# Altium schematic sheet 05 - SAMA7G54-DDR3.SchDoc
size B; CompanyName: Microchip Technology Inc.; Organization: Microchip Technology; Address1: 2355 West Chandler Blvd.; Address2: Chandler, AZ  85224; Address4: USA; SheetNumber: 6; SheetTotal: 15; SheetTitle: SAMA7G5-DDR3; Time: Time
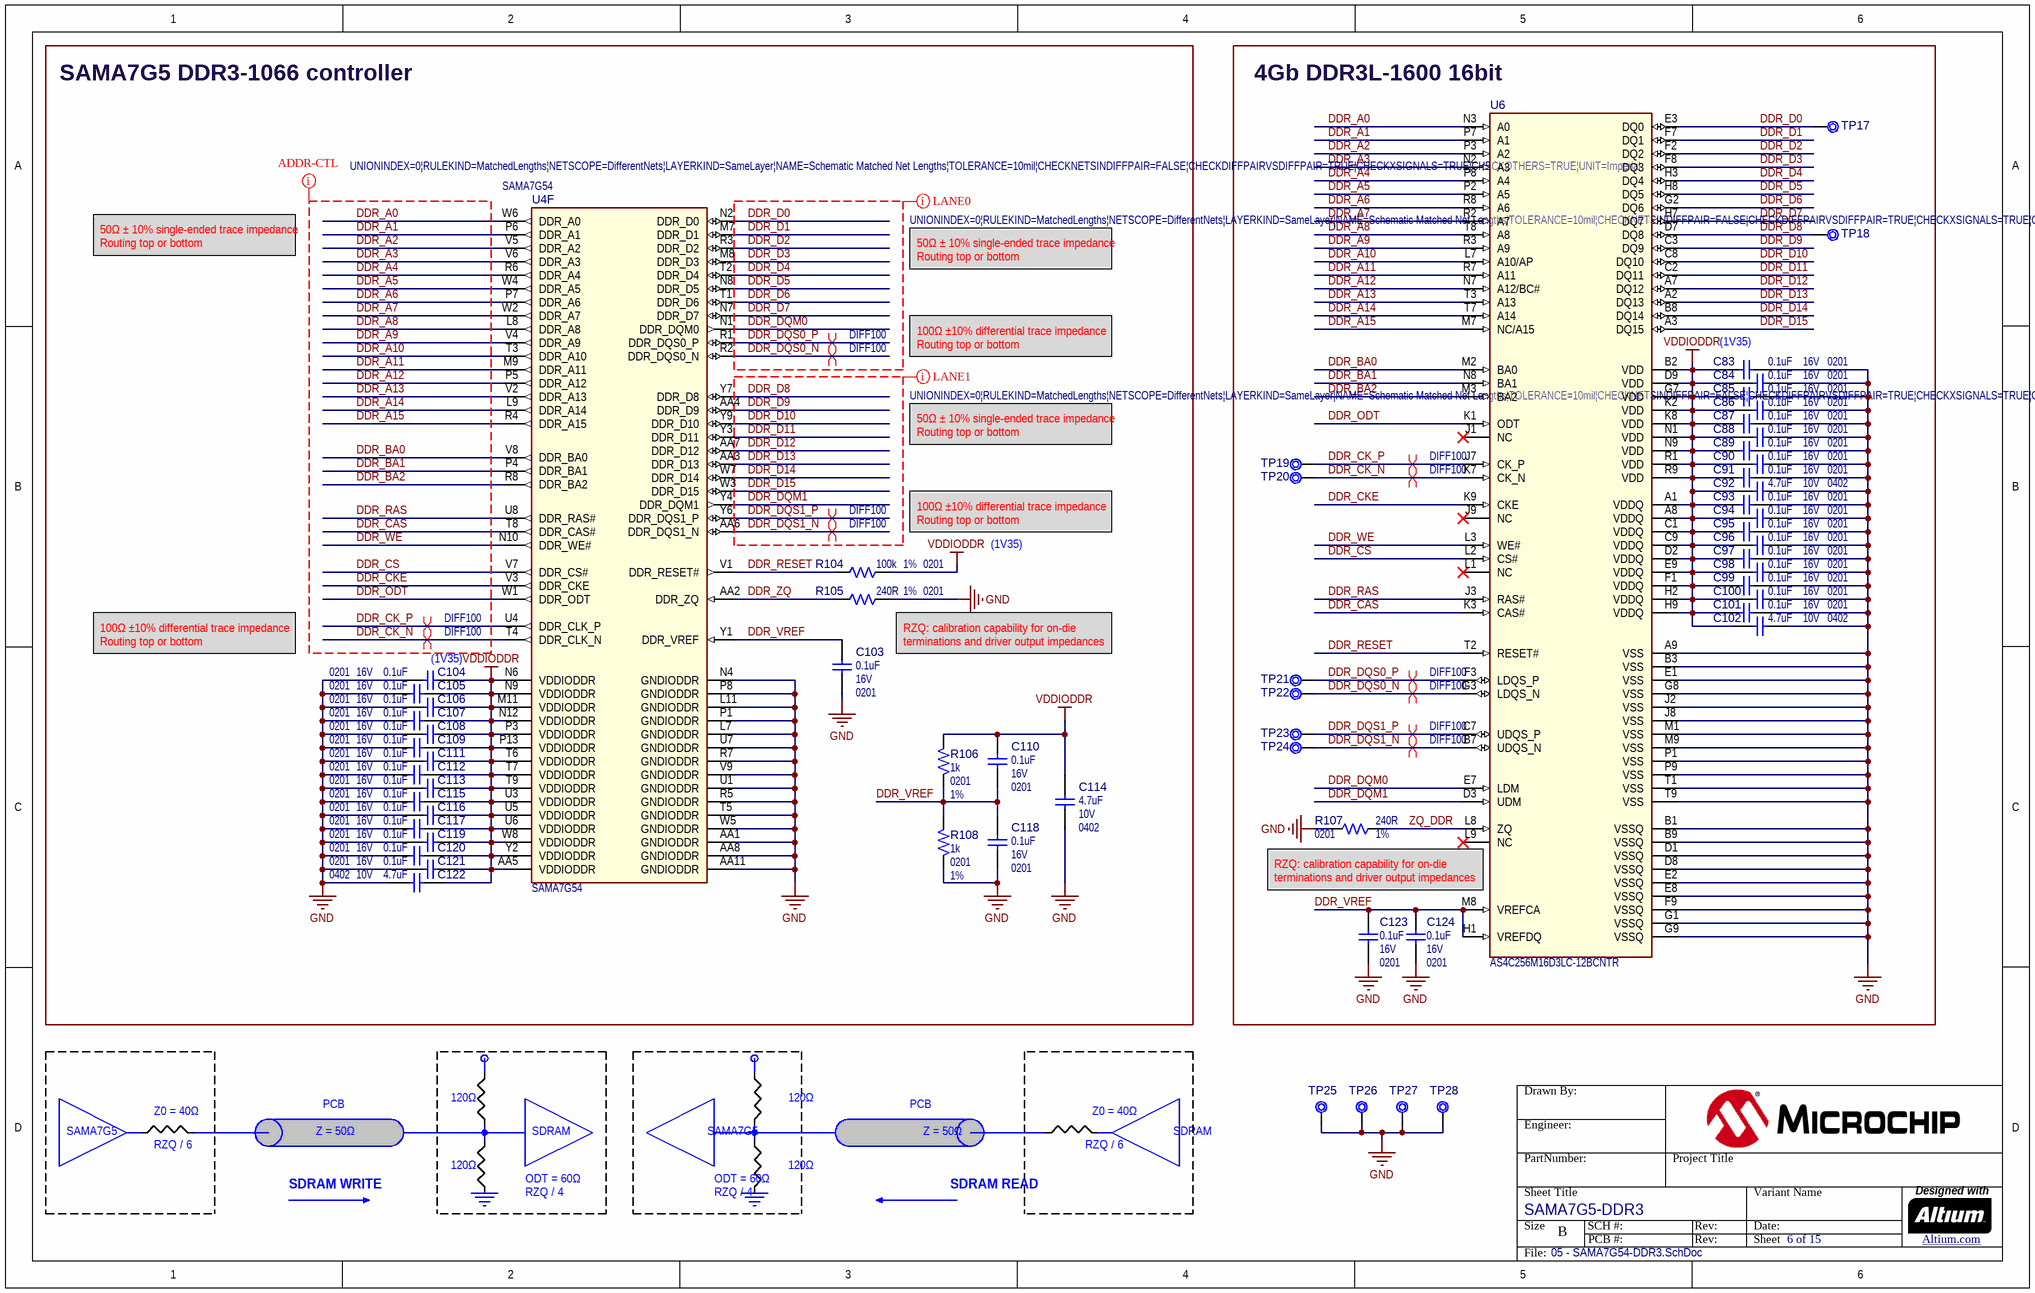
[diagram p0: 05 - SAMA7G54-DDR3.SchDoc]

## Parts
?  (no value)  (graphical)
C83  value 0.1uF  Voltage: 16V  Package: 0201  [CAP_C_0201]  (hidden comment: Capacitor NP)
C84  value 0.1uF  Voltage: 16V  Package: 0201  [CAP_C_0201]  (hidden comment: Capacitor NP)
C85  value 0.1uF  Voltage: 16V  Package: 0201  [CAP_C_0201]  (hidden comment: Capacitor NP)
C86  value 0.1uF  Voltage: 16V  Package: 0201  [CAP_C_0201]  (hidden comment: Capacitor NP)
C87  value 0.1uF  Voltage: 16V  Package: 0201  [CAP_C_0201]  (hidden comment: Capacitor NP)
C88  value 0.1uF  Voltage: 16V  Package: 0201  [CAP_C_0201]  (hidden comment: Capacitor NP)
C89  value 0.1uF  Voltage: 16V  Package: 0201  [CAP_C_0201]  (hidden comment: Capacitor NP)
C90  value 0.1uF  Voltage: 16V  Package: 0201  [CAP_C_0201]  (hidden comment: Capacitor NP)
C91  value 0.1uF  Voltage: 16V  Package: 0201  [CAP_C_0201]  (hidden comment: Capacitor NP)
C92  value 4.7uF  Voltage: 10V  Package: 0402  [CAP_C_0402]  (hidden comment: Capacitor NP)
C93  value 0.1uF  Voltage: 16V  Package: 0201  [CAP_C_0201]  (hidden comment: Capacitor NP)
C94  value 0.1uF  Voltage: 16V  Package: 0201  [CAP_C_0201]  (hidden comment: Capacitor NP)
C95  value 0.1uF  Voltage: 16V  Package: 0201  [CAP_C_0201]  (hidden comment: Capacitor NP)
C96  value 0.1uF  Voltage: 16V  Package: 0201  [CAP_C_0201]  (hidden comment: Capacitor NP)
C97  value 0.1uF  Voltage: 16V  Package: 0201  [CAP_C_0201]  (hidden comment: Capacitor NP)
C98  value 0.1uF  Voltage: 16V  Package: 0201  [CAP_C_0201]  (hidden comment: Capacitor NP)
C99  value 0.1uF  Voltage: 16V  Package: 0201  [CAP_C_0201]  (hidden comment: Capacitor NP)
C100  value 0.1uF  Voltage: 16V  Package: 0201  [CAP_C_0201]  (hidden comment: Capacitor NP)
C101  value 0.1uF  Voltage: 16V  Package: 0201  [CAP_C_0201]  (hidden comment: Capacitor NP)
C102  value 4.7uF  Voltage: 10V  Package: 0402  [CAP_C_0402]  (hidden comment: Capacitor NP)
C103  value 0.1uF  Voltage: 16V  Package: 0201  [CAP_C_0201]  (hidden comment: Capacitor NP)
C104  value 0.1uF  Voltage: 16V  Package: 0201  [CAP_C_0201]  (hidden comment: Capacitor NP)
C105  value 0.1uF  Voltage: 16V  Package: 0201  [CAP_C_0201]  (hidden comment: Capacitor NP)
C106  value 0.1uF  Voltage: 16V  Package: 0201  [CAP_C_0201]  (hidden comment: Capacitor NP)
C107  value 0.1uF  Voltage: 16V  Package: 0201  [CAP_C_0201]  (hidden comment: Capacitor NP)
C108  value 0.1uF  Voltage: 16V  Package: 0201  [CAP_C_0201]  (hidden comment: Capacitor NP)
C109  value 0.1uF  Voltage: 16V  Package: 0201  [CAP_C_0201]  (hidden comment: Capacitor NP)
C110  value 0.1uF  Voltage: 16V  Package: 0201  [CAP_C_0201]  (hidden comment: Capacitor NP)
C111  value 0.1uF  Voltage: 16V  Package: 0201  [CAP_C_0201]  (hidden comment: Capacitor NP)
C112  value 0.1uF  Voltage: 16V  Package: 0201  [CAP_C_0201]  (hidden comment: Capacitor NP)
C113  value 0.1uF  Voltage: 16V  Package: 0201  [CAP_C_0201]  (hidden comment: Capacitor NP)
C114  value 4.7uF  Voltage: 10V  Package: 0402  [CAP_C_0402]  (hidden comment: Capacitor NP)
C115  value 0.1uF  Voltage: 16V  Package: 0201  [CAP_C_0201]  (hidden comment: Capacitor NP)
C116  value 0.1uF  Voltage: 16V  Package: 0201  [CAP_C_0201]  (hidden comment: Capacitor NP)
C117  value 0.1uF  Voltage: 16V  Package: 0201  [CAP_C_0201]  (hidden comment: Capacitor NP)
C118  value 0.1uF  Voltage: 16V  Package: 0201  [CAP_C_0201]  (hidden comment: Capacitor NP)
C119  value 0.1uF  Voltage: 16V  Package: 0201  [CAP_C_0201]  (hidden comment: Capacitor NP)
C120  value 0.1uF  Voltage: 16V  Package: 0201  [CAP_C_0201]  (hidden comment: Capacitor NP)
C121  value 0.1uF  Voltage: 16V  Package: 0201  [CAP_C_0201]  (hidden comment: Capacitor NP)
C122  value 4.7uF  Voltage: 10V  Package: 0402  [CAP_C_0402]  (hidden comment: Capacitor NP)
C123  value 0.1uF  Voltage: 16V  Package: 0201  [CAP_C_0201]  (hidden comment: Capacitor NP)
C124  value 0.1uF  Voltage: 16V  Package: 0201  [CAP_C_0201]  (hidden comment: Capacitor NP)
R104  value 100k  Package: 0201  Tolerance: 1%  [RES_C_0201]  (hidden comment: Resistor)
R105  value 240R  Package: 0201  Tolerance: 1%  [RES_C_0201]  (hidden comment: Resistor)
R106  value 1k  Package: 0201  Tolerance: 1%  [RES_C_0201]  (hidden comment: Resistor)
R107  value 240R  Package: 0201  Tolerance: 1%  [RES_C_0201]  (hidden comment: Resistor)
R108  value 1k  Package: 0201  Tolerance: 1%  [RES_C_0201]  (hidden comment: Resistor)
TP17  Test Point No BOM  [TP_1mm_SMD]  (value not drawn)  (no BOM)
TP18  Test Point No BOM  [TP_1mm_SMD]  (value not drawn)  (no BOM)
TP19  Test Point No BOM  [TP_1mm_SMD]  (value not drawn)  (no BOM)
TP20  Test Point No BOM  [TP_1mm_SMD]  (value not drawn)  (no BOM)
TP21  Test Point No BOM  [TP_1mm_SMD]  (value not drawn)  (no BOM)
TP22  Test Point No BOM  [TP_1mm_SMD]  (value not drawn)  (no BOM)
TP23  Test Point No BOM  [TP_1mm_SMD]  (value not drawn)  (no BOM)
TP24  Test Point No BOM  [TP_1mm_SMD]  (value not drawn)  (no BOM)
TP25  Test Point No BOM  [TP_1mm_SMD]  (value not drawn)  (no BOM)
TP26  Test Point No BOM  [TP_1mm_SMD]  (value not drawn)  (no BOM)
TP27  Test Point No BOM  [TP_1mm_SMD]  (value not drawn)  (no BOM)
TP28  Test Point No BOM  [TP_1mm_SMD]  (value not drawn)  (no BOM)
U4  SAMA7G54  [TFBGA-343_14x14]  (part F of 8)
U6  value AS4C256M16D3LC-12BCNTR  [TFBGA-96_13.5x7.5]  (hidden comment: AS4C256M16D3LC-12BINTRMT41K256M16TW-107)

## Blocks framed on the sheet
SAMA7G5 DDR3-1066 controller: C103-C122 R104-R106 R108 U4
4Gb DDR3L-1600 16bit: C83-C102 C123 C124 R107 TP17-TP24 U6

## Nets
GND: C83.2 C84.2 C85.2 C86.2 C87.2 C88.2 C89.2 C90.2 C91.2 C92.2 C93.2 C94.2 C95.2 C96.2 C97.2 C98.2 C99.2 C100.2 C101.2 C102.2 C103.1 C104.2 C105.2 C106.2 C107.2 C108.2 C109.2 C111.2 C112.2 C113.2 C114.1 C115.2 C116.2 C117.2 C118.1 C119.2 C120.2 C121.2 C122.2 C123.1 C124.1 R105.2 R107.1 R108.1 TP25.1 TP26.1 TP27.1 TP28.1 U4.AA1(GNDIODDR) U4.AA8(GNDIODDR) U4.AA11(GNDIODDR) U4.L7(GNDIODDR) U4.L11(GNDIODDR) U4.N4(GNDIODDR) U4.P1(GNDIODDR) U4.P8(GNDIODDR) U4.R5(GNDIODDR) U4.R7(GNDIODDR) U4.T5(GNDIODDR) U4.U1(GNDIODDR) U4.U7(GNDIODDR) U4.V9(GNDIODDR) U4.W5(GNDIODDR) U6.A9(VSS) U6.B1(VSSQ) U6.B3(VSS) U6.B9(VSSQ) U6.D1(VSSQ) U6.D8(VSSQ) U6.E1(VSS) U6.E2(VSSQ) U6.E8(VSSQ) U6.F9(VSSQ) U6.G1(VSSQ) U6.G8(VSS) U6.G9(VSSQ) U6.J2(VSS) U6.J8(VSS) U6.M1(VSS) U6.M9(VSS) U6.P1(VSS) U6.P9(VSS) U6.T1(VSS) U6.T9(VSS)
VDDIODDR: C83.1 C84.1 C85.1 C86.1 C87.1 C88.1 C89.1 C90.1 C91.1 C92.1 C93.1 C94.1 C95.1 C96.1 C97.1 C98.1 C99.1 C100.1 C101.1 C102.1 C104.1 C105.1 C106.1 C107.1 C108.1 C109.1 C110.2 C111.1 C112.1 C113.1 C114.2 C115.1 C116.1 C117.1 C119.1 C120.1 C121.1 C122.1 R104.2 R106.2 U4.AA5(VDDIODDR) U4.M11(VDDIODDR) U4.N6(VDDIODDR) U4.N9(VDDIODDR) U4.N12(VDDIODDR) U4.P3(VDDIODDR) U4.P13(VDDIODDR) U4.T6(VDDIODDR) U4.T7(VDDIODDR) U4.T9(VDDIODDR) U4.U3(VDDIODDR) U4.U5(VDDIODDR) U4.U6(VDDIODDR) U4.W8(VDDIODDR) U4.Y2(VDDIODDR) U6.A1(VDDQ) U6.A8(VDDQ) U6.B2(VDD) U6.C1(VDDQ) U6.C9(VDDQ) U6.D2(VDDQ) U6.D9(VDD) U6.E9(VDDQ) U6.F1(VDDQ) U6.G7(VDD) U6.H2(VDDQ) U6.H9(VDDQ) U6.K2(VDD) U6.K8(VDD) U6.N1(VDD) U6.N9(VDD) U6.R1(VDD) U6.R9(VDD)
DDR_A0: U4.W6(DDR_A0) U6.N3(A0)
DDR_A1: U4.P6(DDR_A1) U6.P7(A1)
DDR_A2: U4.V5(DDR_A2) U6.P3(A2)
DDR_A3: U4.V6(DDR_A3) U6.N2(A3)
DDR_A4: U4.R6(DDR_A4) U6.P8(A4)
DDR_A5: U4.W4(DDR_A5) U6.P2(A5)
DDR_A6: U4.P7(DDR_A6) U6.R8(A6)
DDR_A7: U4.W2(DDR_A7) U6.R2(A7)
DDR_A8: U4.L8(DDR_A8) U6.T8(A8)
DDR_A9: U4.V4(DDR_A9) U6.R3(A9)
DDR_A10: U4.T3(DDR_A10) U6.L7(A10/AP)
DDR_A11: U4.M9(DDR_A11) U6.R7(A11)
DDR_A12: U4.P5(DDR_A12) U6.N7(A12/BC#)
DDR_A13: U4.V2(DDR_A13) U6.T3(A13)
DDR_A14: U4.L9(DDR_A14) U6.T7(A14)
DDR_A15: U4.R4(DDR_A15) U6.M7(NC/A15)
DDR_BA0: U4.V8(DDR_BA0) U6.M2(BA0)
DDR_BA1: U4.P4(DDR_BA1) U6.N8(BA1)
DDR_BA2: U4.R8(DDR_BA2) U6.M3(BA2)
DDR_CAS: U4.T8(DDR_CAS#) U6.K3(CAS#)
DDR_CK_N: TP20.1 U4.T4(DDR_CLK_N) U6.K7(CK_N)
DDR_CK_P: TP19.1 U4.U4(DDR_CLK_P) U6.J7(CK_P)
DDR_CKE: U4.V3(DDR_CKE) U6.K9(CKE)
DDR_CS: U4.V7(DDR_CS#) U6.L2(CS#)
DDR_D0: TP17.1 U4.N2(DDR_D0) U6.E3(DQ0)
DDR_D1: U4.M7(DDR_D1) U6.F7(DQ1)
DDR_D2: U4.R3(DDR_D2) U6.F2(DQ2)
DDR_D3: U4.M8(DDR_D3) U6.F8(DQ3)
DDR_D4: U4.T2(DDR_D4) U6.H3(DQ4)
DDR_D5: U4.N8(DDR_D5) U6.H8(DQ5)
DDR_D6: U4.T1(DDR_D6) U6.G2(DQ6)
DDR_D7: U4.N7(DDR_D7) U6.H7(DQ7)
DDR_D8: TP18.1 U4.Y7(DDR_D8) U6.D7(DQ8)
DDR_D9: U4.AA4(DDR_D9) U6.C3(DQ9)
DDR_D10: U4.Y9(DDR_D10) U6.C8(DQ10)
DDR_D11: U4.Y3(DDR_D11) U6.C2(DQ11)
DDR_D12: U4.AA7(DDR_D12) U6.A7(DQ12)
DDR_D13: U4.AA3(DDR_D13) U6.A2(DQ13)
DDR_D14: U4.W7(DDR_D14) U6.B8(DQ14)
DDR_D15: U4.W3(DDR_D15) U6.A3(DQ15)
DDR_DQM0: U4.N1(DDR_DQM0) U6.E7(LDM)
DDR_DQM1: U4.Y4(DDR_DQM1) U6.D3(UDM)
DDR_DQS0_N: TP22.1 U4.R2(DDR_DQS0_N) U6.G3(LDQS_N)
DDR_DQS0_P: TP21.1 U4.R1(DDR_DQS0_P) U6.F3(LDQS_P)
DDR_DQS1_N: TP24.1 U4.AA6(DDR_DQS1_N) U6.B7(UDQS_N)
DDR_DQS1_P: TP23.1 U4.Y6(DDR_DQS1_P) U6.C7(UDQS_P)
DDR_ODT: U4.W1(DDR_ODT) U6.K1(ODT)
DDR_RAS: U4.U8(DDR_RAS#) U6.J3(RAS#)
DDR_RESET: R104.1 U4.V1(DDR_RESET#) U6.T2(RESET#)
DDR_VREF: C103.2 C110.1 C118.2 C123.2 C124.2 R106.1 R108.2 U4.Y1(DDR_VREF) U6.H1(VREFDQ) U6.M8(VREFCA)
DDR_WE: U4.N10(DDR_WE#) U6.L3(WE#)
DDR_ZQ: R105.1 U4.AA2(DDR_ZQ)
ZQ_DDR: R107.2 U6.L8(ZQ)

Not connected (* = marked no-connect by the designer): U6 J1(NC)* J9(NC)* L1(NC)* L9(NC)*

## Layout directives
differential pair; differential pair class DIFF100; net class DIFF100; rule Matched Net Lengths [Tolerance = 4mil]: DDR_CK_N, DDR_CK_P, DDR_DQS0_N, DDR_DQS0_P, DDR_DQS1_N, DDR_DQS1_P
net class DDR-LANE0; rule Matched Net Lengths [Tolerance = 10mil]: DDR_D0, DDR_D1, DDR_D2, DDR_D3, DDR_D4, DDR_D5, DDR_D6, DDR_D7, DDR_DQM0, DDR_DQS0_N, DDR_DQS0_P
net class DDR-LANE1; rule Matched Net Lengths [Tolerance = 10mil]: DDR_D8, DDR_D9, DDR_D10, DDR_D11, DDR_D12, DDR_D13, DDR_D14, DDR_D15, DDR_DQM1, DDR_DQS1_N, DDR_DQS1_P
net class DDR-ADDR-CTL; rule Matched Net Lengths [Tolerance = 10mil]: DDR_A0, DDR_A1, DDR_A2, DDR_A3, DDR_A4, DDR_A5, DDR_A6, DDR_A7, DDR_A8, DDR_A9, DDR_A10, DDR_A11, DDR_A12, DDR_A13, DDR_A14, DDR_A15, DDR_BA0, DDR_BA1, DDR_BA2, DDR_CAS, DDR_CK_N, DDR_CK_P, DDR_CKE, DDR_CS, DDR_ODT, DDR_RAS, DDR_WE

## Notes on the sheet
- 50Ω ± 10% single-ended trace impedance
  Routing top or bottom
- 100Ω ±10% differential trace impedance
  Routing top or bottom
- (1V35)
- (near C104) (1V35)
- (near R105) RZQ: calibration capability for on-die terminations and driver output impedances
- (near U6) RZQ: calibration capability for on-die terminations and driver output impedances
- PCB
- 120Ω
- SAMA7G5
- Z0 = 40Ω
- RZQ / 6
- Z = 50Ω
- ODT = 60Ω
- SDRAM
- SDRAM WRITE
- RZQ / 4
- SDRAM READ
- Drawn By:
- Engineer:
- PartNumber:
- Project Title
- Sheet Title
- Size
- B
- SCH #:
- PCB #:
- Rev:
- Variant Name
- Date:
- Sheet
- Designed with
- Altium.com <http://go.altium.com/MicrochipLandingPage_Evaluation.html>
- File:

## Library data of the parts
? = Title Block B
C83-C91 C93-C101 C104-C113 C115-C121 = CAP1978: Capacitor; Manufacturer 1: Murata Electronics North America; Manufacturer Part Number 1: GRM033C71C104KE14D; Description_: CAP CER 0.1uF 16V 10% X7S 0201; Dev Tools Status: Design; Tolerance: 10%; Temperature Coeffcient: X7S; Owner: Dragos Danaila; Populated: YES; MCHP-ID: CAP1978; Revision: F; Symbol: Capacitor NP; Status: MCL Design; ComponentLink1URL: https://chn-vm-apps.microchip.com/mchprepo/parts/Datasheets/GRM033C71C104KE14-01.pdf; ComponentLink1Description: SVN Datasheet; ComponentLink2URL: C:\ALTIUM_WORK\00001_MCHP-CDB\Datasheets\GRM033C71C104KE14-01.pdf; ComponentLink2Description: Local Datasheet; ComponentLink3URL: C:\ALTIUM_WORK\00001_MCHP-CDB\Library\LibraryRefs\Capacitor NP.SchLib; ComponentLink3Description: Open Symbol; ComponentLink4URL: C:\ALTIUM_WORK\00001_MCHP-CDB\Library\Footprints\CAP_C_0201.PcbLib; ComponentLink4Description: Open Footprint; ComponentLink5Description: Open Footprint 2; ComponentLink6Description: Open Footprint 3; ComponentLink7Description: Open Footprint 4; Operating Temperature: -55C to +125C; Category: Capacitor; Supplier 1: Digi-Key; Supplier Part Number 1: 490-10387-1-ND; Quantity Override: 1; Manufacturer 2: Murata Electronics; Manufacturer Part Number 2: GRM033C71C104KE14J; Manufacturer 3: Murata Electronics; Manufacturer Part Number 3: GRM033C71C104KE14E; Supplier 2: Mouser; Supplier Part Number 2: 81-GRM033C71C104KE4J; Supplier 3: Mouser; Supplier Part Number 3: 81-GRM033C71C104KE4E
C92 C102 C114 C122 = CAP1684: Capacitor; Manufacturer 1: TDK Corporation; Manufacturer Part Number 1: C1005X5R1A475K050BC; Description_: CAP CER 4.7uF 10V 10% X5R SMD 0402; Dev Tools Status: Production; Tolerance: 10%; Temperature Coeffcient: X5R; Type: Ceramic; Owner: Jesus Aviles; Populated: YES; MCHP-ID: CAP1684; Revision: 1; Symbol: Capacitor NP; Status: MCL Design; ComponentLink1Description: SVN Datasheet; ComponentLink2Description: Local Datasheet; ComponentLink3URL: C:\ALTIUM_WORK\00001_MCHP-CDB\Library\LibraryRefs\Capacitor NP.SchLib; ComponentLink3Description: Open Symbol; ComponentLink4URL: C:\ALTIUM_WORK\00001_MCHP-CDB\Library\Footprints\CAP_C_0402.PcbLib; ComponentLink4Description: Open Footprint; ComponentLink5Description: Open Footprint 2; ComponentLink6Description: Open Footprint 3; ComponentLink7Description: Open Footprint 4; Operating Temperature: -55C to 85C; Category: Capacitor; Supplier 1: Digi-Key; Supplier Part Number 1: 445-13820-1-ND; Quantity Override: 1
C103 C123 C124 = CAP1978: Capacitor; Manufacturer 1: Murata Electronics North America; Manufacturer Part Number 1: GRM033C71C104KE14D; Description_: CAP CER 0.1uF 16V 10% X7S 0201; Dev Tools Status: Design; Tolerance: 10%; Temperature Coeffcient: X7S; Owner: Dragos Danaila; Populated: DNP; MCHP-ID: CAP1978; Revision: F; Symbol: Capacitor NP; Status: MCL Design; ComponentLink1URL: https://chn-vm-apps.microchip.com/mchprepo/parts/Datasheets/GRM033C71C104KE14-01.pdf; ComponentLink1Description: SVN Datasheet; ComponentLink2URL: C:\ALTIUM_WORK\00001_MCHP-CDB\Datasheets\GRM033C71C104KE14-01.pdf; ComponentLink2Description: Local Datasheet; ComponentLink3URL: C:\ALTIUM_WORK\00001_MCHP-CDB\Library\LibraryRefs\Capacitor NP.SchLib; ComponentLink3Description: Open Symbol; ComponentLink4URL: C:\ALTIUM_WORK\00001_MCHP-CDB\Library\Footprints\CAP_C_0201.PcbLib; ComponentLink4Description: Open Footprint; ComponentLink5Description: Open Footprint 2; ComponentLink6Description: Open Footprint 3; ComponentLink7Description: Open Footprint 4; Operating Temperature: -55C to +125C; Category: Capacitor; Supplier 1: Digi-Key; Supplier Part Number 1: 490-10387-1-ND; Quantity Override: 1; Manufacturer 2: Murata Electronics; Manufacturer Part Number 2: GRM033C71C104KE14J; Manufacturer 3: Murata Electronics; Manufacturer Part Number 3: GRM033C71C104KE14E; Supplier 2: Mouser; Supplier Part Number 2: 81-GRM033C71C104KE4J; Supplier 3: Mouser; Supplier Part Number 3: 81-GRM033C71C104KE4E
R104 = RSMT1356: Manufacturer 1: Stackpole Electronics Inc; Manufacturer Part Number 1: RMCF0201FT100K; Description_: RES TKF 100k 1% 1/20W SMD 0201; Dev Tools Status: Design; Voltage: 25V; Power: 1/20W; Owner: Ciprian Abramov; Populated: YES; Temperature Coefficient: 200ppm/C; MCHP-ID: RSMT1356; Revision: 1; Symbol: Resistor; Status: MCL Design; ComponentLink1URL: https://chn-vm-apps.microchip.com/mchprepo/parts/Datasheets/sei-rmcf_rmcp.pdf; ComponentLink1Description: SVN Datasheet; ComponentLink2URL: C:\ALTIUM_WORK\00001_MCHP-CDB\Datasheets\sei-rmcf_rmcp.pdf; ComponentLink2Description: Local Datasheet; ComponentLink3URL: C:\ALTIUM_WORK\00001_MCHP-CDB\Library\LibraryRefs\Resistor.SchLib; ComponentLink3Description: Open Symbol; ComponentLink4URL: C:\ALTIUM_WORK\00001_MCHP-CDB\Library\Footprints\RES_C_0201.PcbLib; ComponentLink4Description: Open Footprint; ComponentLink5Description: Open Footprint 2; ComponentLink6Description: Open Footprint 3; ComponentLink7Description: Open Footprint 4; Operating Temperature: -55C to +125C; Category: Resistor; Type: RES SMD; Composition: TKF; Supplier 1: Digi-Key; Supplier Part Number 1: RMCF0201FT100KCT-ND; Quantity Override: 1
R105 R107 = RSMT1295: Manufacturer 1: Stackpole Electronics Inc; Manufacturer Part Number 1: RMCF0201FT240R; Description_: RES TKF 240R 1/20W SMD 0201; Dev Tools Status: Design; Voltage: 25V; Temperature Coeffcient: 200ppm/C; Power: 1/20W; Owner: Dragos Danaila; Populated: YES; MCHP-ID: RSMT1295; Revision: 1; Symbol: Resistor; Status: MCL Design; ComponentLink1URL: https://chn-vm-apps.microchip.com/mchprepo/parts/Datasheets/sei-rmcf_rmcp.pdf; ComponentLink1Description: SVN Datasheet; ComponentLink2URL: C:\ALTIUM_WORK\00001_MCHP-CDB\Datasheets\sei-rmcf_rmcp.pdf; ComponentLink2Description: Local Datasheet; ComponentLink3URL: C:\ALTIUM_WORK\00001_MCHP-CDB\Library\LibraryRefs\Resistor.SchLib; ComponentLink3Description: Open Symbol; ComponentLink4URL: C:\ALTIUM_WORK\00001_MCHP-CDB\Library\Footprints\RES_C_0201.PcbLib; ComponentLink4Description: Open Footprint; ComponentLink5Description: Open Footprint 2; ComponentLink6Description: Open Footprint 3; ComponentLink7Description: Open Footprint 4; Operating Temperature: -55C to 125C; Category: Resistor; Type: RES SMD; Composition: TKF; Supplier 1: Digikey; Supplier Part Number 1: RMCF0201FT240RCT-ND; Quantity Override: 1
R106 R108 = RSMT1357: Manufacturer 1: Yageo; Manufacturer Part Number 1: RC0201FR-071KL; Description_: RES TKF 1k 1% 1/20W SMD 0201; Dev Tools Status: Design; Voltage: 25V; Power: 1/20W; Owner: Ciprian Abramov; Populated: YES; Temperature Coefficient: 200ppm/C; MCHP-ID: RSMT1357; Revision: 1; Symbol: Resistor; Status: MCL Design; ComponentLink1URL: https://chn-vm-apps.microchip.com/mchprepo/parts/Datasheets/PYu-RC_Group_51_RoHS_L_11.pdf; ComponentLink1Description: SVN Datasheet; ComponentLink2URL: C:\ALTIUM_WORK\00001_MCHP-CDB\Datasheets\PYu-RC_Group_51_RoHS_L_11.pdf; ComponentLink2Description: Local Datasheet; ComponentLink3URL: C:\ALTIUM_WORK\00001_MCHP-CDB\Library\LibraryRefs\Resistor.SchLib; ComponentLink3Description: Open Symbol; ComponentLink4URL: C:\ALTIUM_WORK\00001_MCHP-CDB\Library\Footprints\RES_C_0201.PcbLib; ComponentLink4Description: Open Footprint; ComponentLink5Description: Open Footprint 2; ComponentLink6Description: Open Footprint 3; ComponentLink7Description: Open Footprint 4; Operating Temperature: -55C to +125C; Category: Resistor; Type: RES SMD; Composition: TKF; Supplier 1: Digi-Key; Supplier Part Number 1: 311-1KMCT-ND; Quantity Override: 1
TP17-TP28 = CON1759: Test Point; Value: TP PAD PCB 1mm; Description_: CON TP PAD PCB 1mm SMD; Dev Tools Status: Design; Owner: Cristian Papuc; Populated: YES; MCHP-ID: CON1759; Revision: A; Symbol: Test Point No BOM; Status: MCL Design; ComponentLink1Description: SVN Datasheet; ComponentLink2Description: Local Datasheet; ComponentLink3URL: C:\ALTIUM_WORK\00001_MCHP-CDB\Library\LibraryRefs\Test Point No BOM.SchLib; ComponentLink3Description: Open Symbol; ComponentLink4URL: C:\ALTIUM_WORK\00001_MCHP-CDB\Library\Footprints\TP_1mm_SMD.PcbLib; ComponentLink4Description: Open Footprint; ComponentLink5Description: Open Footprint 2; ComponentLink6Description: Open Footprint 3; ComponentLink7Description: Open Footprint 4; Type: Test Point; Category: Connector; Quantity Override: 1
U4 = MIC8923: SAMA7G54 MPU 1000MHz Cortex-A7 TFBGA-343; Manufacturer Part Number 1: SAMA7G54-V/4HB; Manufacturer 1: Microchip; Description_: MCHP MPU 32-BIT Cortex-A7 1000MHz 128kB SAMA7G54-V/4HB TFBGA-343; Populated: YES; Dev Tools Status: Design; Owner: Ciprian Abramov; Package: TFBGA-343; MCHP-ID: MIC8923; Value: SAMA7G54; Symbol: SAMA7G54 TFBGA-343; Type: 32-Bit MPU; Status: MCL Design; Revision: 1; Category: MCHP-Microcontroller; ComponentLink1Description: SVN Datasheet; ComponentLink2Description: Local Datasheet; ComponentLink3URL: C:\ALTIUM_WORK\00001_MCHP-CDB\Library\LibraryRefs\SAMA7G54 TFBGA-343.SchLib; ComponentLink3Description: Open Symbol; ComponentLink4URL: C:\ALTIUM_WORK\00001_MCHP-CDB\Library\Footprints\TFBGA-343_14x14.PcbLib; ComponentLink4Description: Open Footprint; ComponentLink5Description: Open Footprint 2; ComponentLink6Description: Open Footprint 3; ComponentLink7Description: Open Footprint 4; Supplier 1: Microchip; Supplier Part Number 1: SAMA7G54-V/4HB; Quantity Override: 1
U6 = IC2020: 4Gb DDR3L-1600 SDRAM, 256Mb x 16; Manufacturer 1: Alliance Memory, Inc.; MCHP-ID: IC2020; Description_: IC MEMORY AS4C256M16D3LC-12BCNTR DDR3L 4Gb 800MHz FBGA-96; Dev Tools Status: Design; Vin: 1.35V; Owner: Ciprian Abramov; Populated: YES; Revision: 1; Symbol: AS4C256M16D3LC-12BINTR TFBGA-96; Status: MCL Design; Package: FBGA-96; ComponentLink1URL: https://chn-vm-apps.microchip.com/mchprepo/parts/Datasheets/AllianceMemory_4G_DDR3L_AS4C256M16D3LC_March2020_Rev1.0.pdf; ComponentLink1Description: SVN Datasheet; ComponentLink2URL: C:\ALTIUM_WORK\00001_MCHP-CDB\Datasheets\AllianceMemory_4G_DDR3L_AS4C256M16D3LC_March2020_Rev1.0.pdf; ComponentLink2Description: Local Datasheet; ComponentLink3URL: C:\ALTIUM_WORK\00001_MCHP-CDB\Library\LibraryRefs\AS4C256M16D3LC-12BINTR TFBGA-96.SchLib; ComponentLink3Description: Open Symbol; ComponentLink4URL: C:\ALTIUM_WORK\00001_MCHP-CDB\Library\Footprints\TFBGA-96_13.5x7.5.PcbLib; ComponentLink4Description: Open Footprint; ComponentLink5Description: Open Footprint 2; ComponentLink6Description: Open Footprint 3; ComponentLink7Description: Open Footprint 4; Operating Temperature: 0C to +95C; Type: Memory; Category: IC; Manufacturer Part Number 1: AS4C256M16D3LC-12BCNTR; Supplier 1: Digi-Key; Supplier Part Number 1: 1450-AS4C256M16D3LC-12BCNCT-ND; Quantity Override: 1